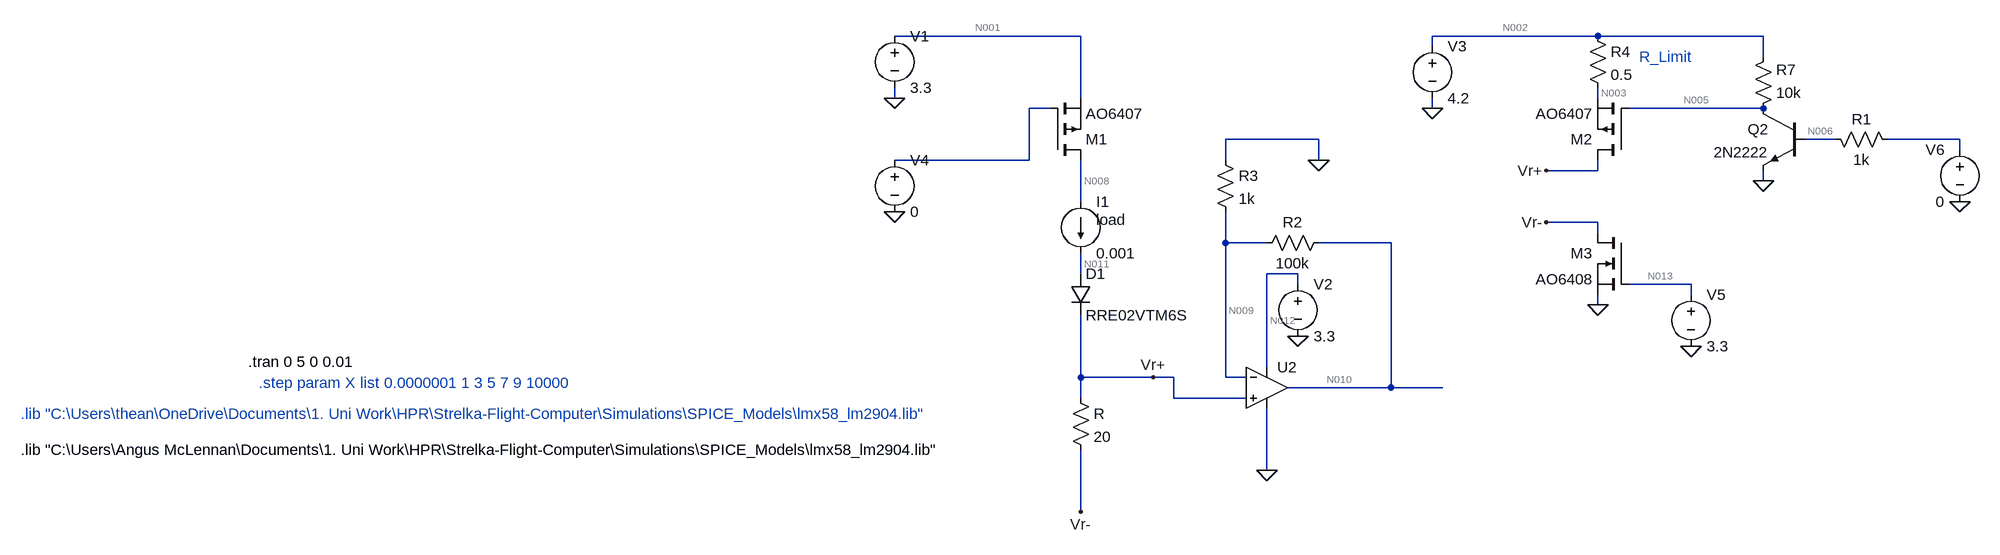
[diagram p0: schematic Continuity_Test.asc]
Continuity_Test.asc, the LTspice schematic file:
Version 4
SHEET 1 1828 680
WIRE 288 -496 0 -496
WIRE 1088 -496 832 -496
WIRE 1344 -496 1088 -496
WIRE 832 -480 832 -496
WIRE 1344 -464 1344 -496
WIRE 0 -400 0 -416
WIRE 288 -400 288 -496
WIRE 1088 -400 1088 -416
WIRE 240 -384 208 -384
WIRE 832 -384 832 -400
WIRE 1344 -384 1136 -384
WIRE 656 -336 512 -336
WIRE 1456 -336 1408 -336
WIRE 1648 -336 1536 -336
WIRE 1648 -320 1648 -336
WIRE 208 -304 208 -384
WIRE 208 -304 0 -304
WIRE 512 -304 512 -336
WIRE 656 -304 656 -336
WIRE 1088 -288 1088 -304
WIRE 1088 -288 1008 -288
WIRE 1344 -272 1344 -288
WIRE 288 -240 288 -304
WIRE 1088 -208 1008 -208
WIRE 1088 -192 1088 -208
WIRE 512 -176 512 -224
WIRE 576 -176 512 -176
WIRE 768 -176 656 -176
WIRE 288 -128 288 -160
WIRE 624 -128 576 -128
WIRE 624 -112 624 -128
WIRE 1232 -112 1136 -112
WIRE 1232 -96 1232 -112
WIRE 1088 -80 1088 -96
WIRE 576 16 576 -128
WIRE 288 32 288 -64
WIRE 400 32 288 32
WIRE 432 32 400 32
WIRE 512 32 512 -176
WIRE 544 32 512 32
WIRE 768 48 768 -176
WIRE 768 48 608 48
WIRE 848 48 768 48
WIRE 288 64 288 32
WIRE 432 64 432 32
WIRE 544 64 432 64
WIRE 576 176 576 80
WIRE 288 240 288 144
FLAG 576 176 0
FLAG 832 -384 0
FLAG 400 32 Vr+
FLAG 624 -32 0
FLAG 656 -304 0
FLAG 288 240 Vr-
FLAG 1008 -208 Vr-
FLAG 1008 -288 Vr+
FLAG 1088 -80 0
FLAG 1232 -16 0
FLAG 1344 -272 0
FLAG 1648 -240 0
FLAG 0 -400 0
FLAG 0 -224 0
SYMBOL current 288 -240 R0
WINDOW 123 0 0 Left 0
WINDOW 39 24 28 Left 2
SYMATTR SpiceLine load
SYMATTR InstName I1
SYMATTR Value 0.001
SYMBOL res 272 48 R0
SYMATTR InstName R
SYMATTR Value 20
SYMATTR Prefix ""
SYMBOL voltage 624 -128 R0
WINDOW 123 0 0 Left 0
WINDOW 39 0 0 Left 0
SYMATTR InstName V2
SYMATTR Value 3.3
SYMBOL pmos 240 -304 M180
SYMATTR InstName M1
SYMATTR Value AO6407
SYMBOL voltage 832 -496 R0
WINDOW 123 0 0 Left 0
WINDOW 39 0 0 Left 0
SYMATTR InstName V3
SYMATTR Value 4.2
SYMBOL res 672 -192 R90
WINDOW 0 0 56 VBottom 2
WINDOW 3 32 56 VTop 2
SYMATTR InstName R2
SYMATTR Value 100k
SYMBOL res 496 -320 R0
SYMATTR InstName R3
SYMATTR Value 1k
SYMBOL pmos 1136 -304 R180
SYMATTR InstName M2
SYMATTR Value AO6407
SYMBOL nmos 1136 -192 M0
SYMATTR InstName M3
SYMATTR Value AO6408
SYMBOL voltage 1232 -112 R0
WINDOW 123 0 0 Left 0
WINDOW 39 0 0 Left 0
SYMATTR InstName V5
SYMATTR Value 3.3
SYMBOL res 1072 -512 R0
SYMATTR InstName R4
SYMATTR Value 0.5
SYMBOL Opamps\\UniversalOpamp2 576 48 R0
SYMATTR InstName U2
SYMBOL npn 1408 -384 M0
SYMATTR InstName Q2
SYMATTR Value 2N2222
SYMBOL res 1440 -352 M90
WINDOW 0 0 56 VBottom 2
WINDOW 3 32 56 VTop 2
SYMATTR InstName R1
SYMATTR Value 1k
SYMBOL res 1328 -368 M180
WINDOW 0 36 76 Left 2
WINDOW 3 36 40 Left 2
SYMATTR InstName R7
SYMATTR Value 10k
SYMBOL voltage 1648 -336 M0
WINDOW 123 0 0 Left 0
WINDOW 39 0 0 Left 0
SYMATTR InstName V6
SYMATTR Value 0
SYMBOL voltage 0 -512 R0
WINDOW 123 0 0 Left 0
WINDOW 39 0 0 Left 0
SYMATTR InstName V1
SYMATTR Value 3.3
SYMBOL voltage 0 -320 R0
WINDOW 123 0 0 Left 0
WINDOW 39 0 0 Left 0
SYMATTR InstName V4
SYMATTR Value 0
SYMBOL diode 272 -128 R0
SYMATTR InstName D1
SYMATTR Value RRE02VTM6S
TEXT -1000 8 Left 2 !.tran 0 5 0 0.01
TEXT -984 40 Left 2 ;.step param X list 0.0000001 1 3 5 7 9 10000
TEXT -1352 88 Left 2 ;.lib "C:\\Users\\thean\\OneDrive\\Documents\\1. Uni Work\\HPR\\Strelka-Flight-Computer\\Simulations\\SPICE_Models\\lmx58_lm2904.lib"
TEXT 1152 -464 Left 2 ;R_Limit
TEXT -1352 144 Left 2 !.lib "C:\\Users\\Angus McLennan\\Documents\\1. Uni Work\\HPR\\Strelka-Flight-Computer\\Simulations\\SPICE_Models\\lmx58_lm2904.lib"

The netlist it stands for:
* Continuity_Test.asc
I1 N008 N011 0.001 load
XR Vr+ Vr- 20  ; pins A B
V2 N012 0 3.3
M1 N008 N004 N001 N001 AO6407
V3 N002 0 4.2
R2 N010 N009 100k
R3 0 N009 1k
M2 Vr+ N005 N003 N003 AO6407
M3 Vr- N013 0 0 AO6408
V5 N013 0 3.3
R4 N002 N003 0.5
XU2 Vr+ N009 N012 0 N010 level.2 Avol=1Meg GBW=10Meg Slew=10Meg ilimit=25m rail=0 Vos=0 phimargin=45 en=0 enk=0 in=0 ink=0 Rin=500Meg  ; pins IN+ IN- V+ V- OUT
Q2 N005 N006 0 0 2N2222
R1 N006 N007 1k
R7 N005 N002 10k
V6 N007 0 0
V1 N001 0 3.3
V4 N004 0 0
D1 N011 Vr+ RRE02VTM6S
.model D D
.lib standard.dio
.model NPN NPN
.model PNP PNP
.lib standard.bjt
.model NMOS NMOS
.model PMOS PMOS
.lib standard.mos
.tran 0 5 0 0.01
* .step param X list 0.0000001 1 3 5 7 9 10000
* .lib "C:\Users\thean\OneDrive\Documents\1. Uni Work\HPR\Strelka-Flight-Computer\Simulations\SPICE_Models\lmx58_lm2904.lib"
* R_Limit
.lib "C:\Users\Angus McLennan\Documents\1. Uni Work\HPR\Strelka-Flight-Computer\Simulations\SPICE_Models\lmx58_lm2904.lib"
.lib UniversalOpamps2.sub
.backanno
.end

* Results of the author's LTspice run, read from the files saved beside the schematic
* Operating Point, zero values left out:
*   V(n008) = 3.3 V
*   V(n011) = 683.8 mV
*   V(vr+) = 20.01 mV
*   V(vr-) = 13.23 µV
*   V(n012) = 3.3 V
*   V(n001) = 3.3 V
*   V(n002) = 4.2 V
*   V(n010) = 2.021 V
*   V(n009) = 20.01 mV
*   V(n005) = 4.2 V
*   V(n003) = 4.2 V
*   V(n013) = 3.3 V
*   V(n006) = 4.203 nV
*   Ic(Q2) = 4.213 pA
*   Ib(Q2) = -4.203 pA
*   Id(M3) = 1 mA
*   Is(M3) = -1 mA
*   Id(M2) = -18.03 nA
*   Is(M2) = 18.03 nA
*   Id(M1) = -1 mA
*   Is(M1) = 1 mA
*   I(D1) = 1 mA
*   I(I1) = 1 mA
*   I(R7) = -4.214 pA
*   I(R1) = 4.203 pA
*   I(R4) = 18.03 nA
*   I(R3) = -20.01 µA
*   I(R2) = 20.01 µA
*   I(R) = 1 mA
*   I(V1) = -1 mA
*   I(V6) = 4.203 pA
*   I(V3) = -18.04 nA
*   I(V2) = -171.1 µA
*   Ix(u2:1) = -3.26 nA
*   Ix(u2:2) = -3.26 nA
*   Ix(u2:3) = 171.1 µA
*   Ix(u2:4) = -151.1 µA
*   Ix(u2:5) = -20.01 µA